# Altium schematic sheet Micro_Grid_Sch.SchDoc: Mini Grid Project
size 558 x 431 mm; Date: Nov 2024; ApprovedBy: -; CheckedBy: -; Author: Rushikesh R. Shirsat; DrawnBy: Rushikesh Shirsat; Engineer: Rushikesh Shirsat; Organization: -; Address1: Chicago, IL, USA; Address2: -; Address3: -; Address4: -; DocumentNumber: -; Revision: 1.0; SheetNumber: 1; SheetTotal: 1
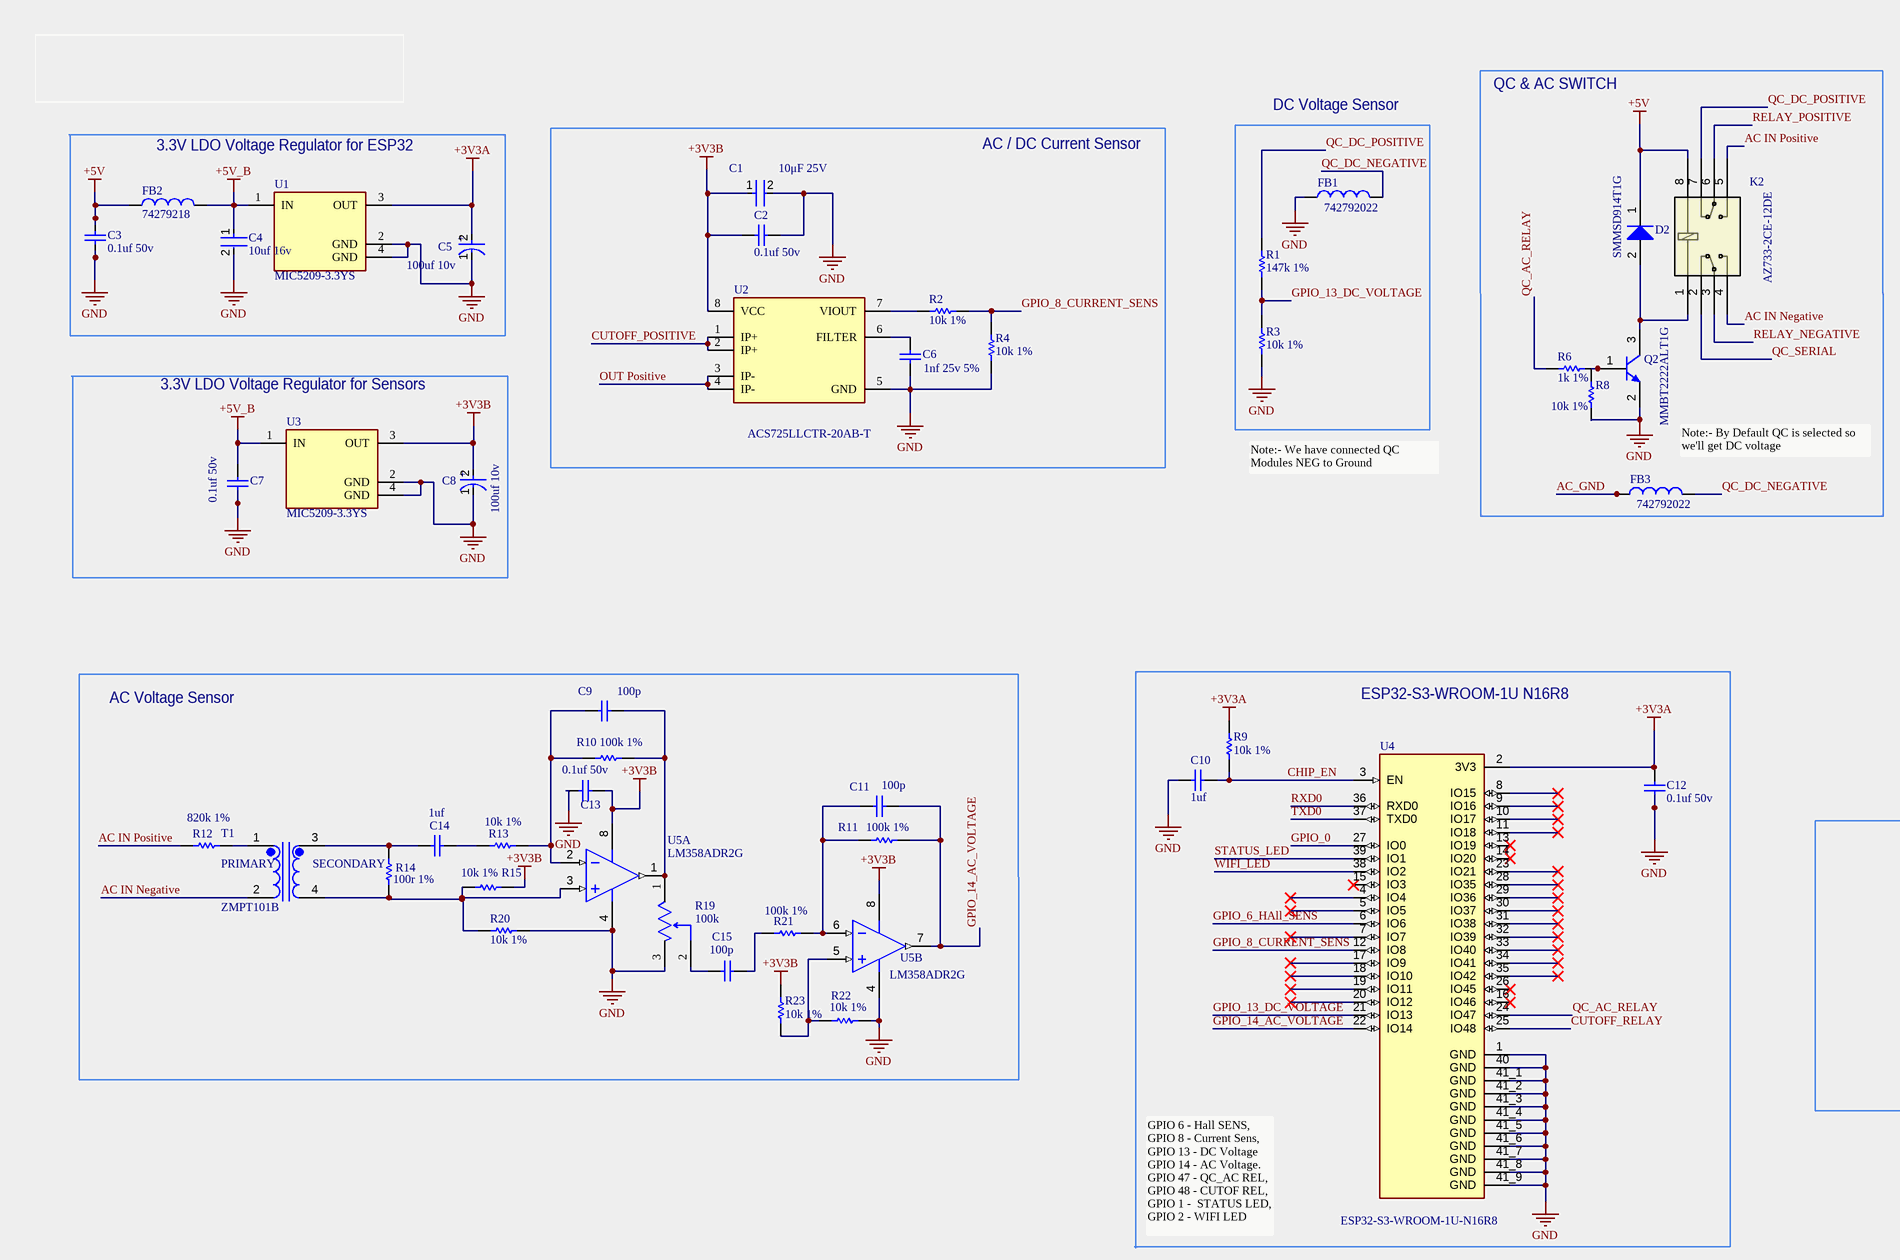
[diagram p0: Micro_Grid_Sch.SchDoc, top left]
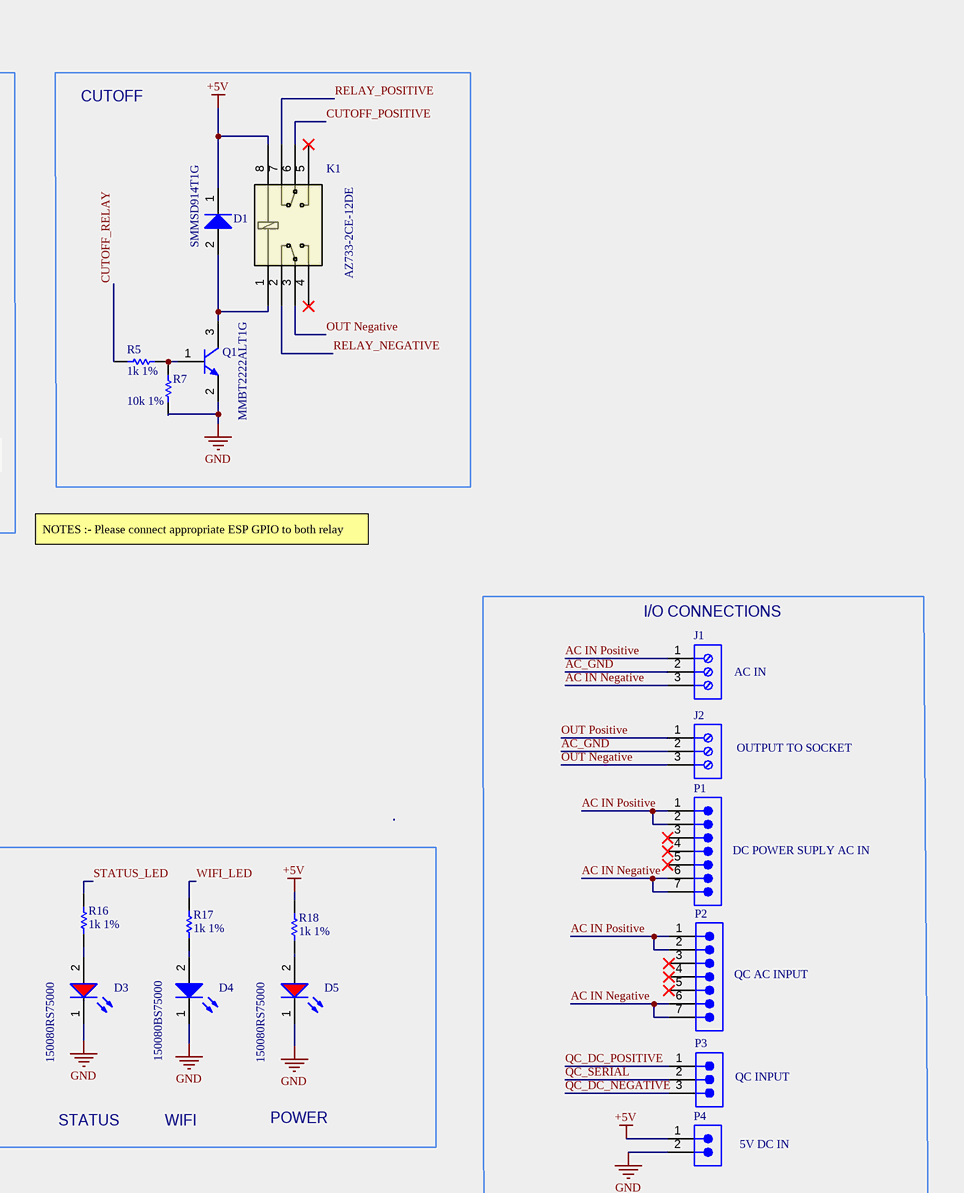
[diagram p1: Micro_Grid_Sch.SchDoc, top right]
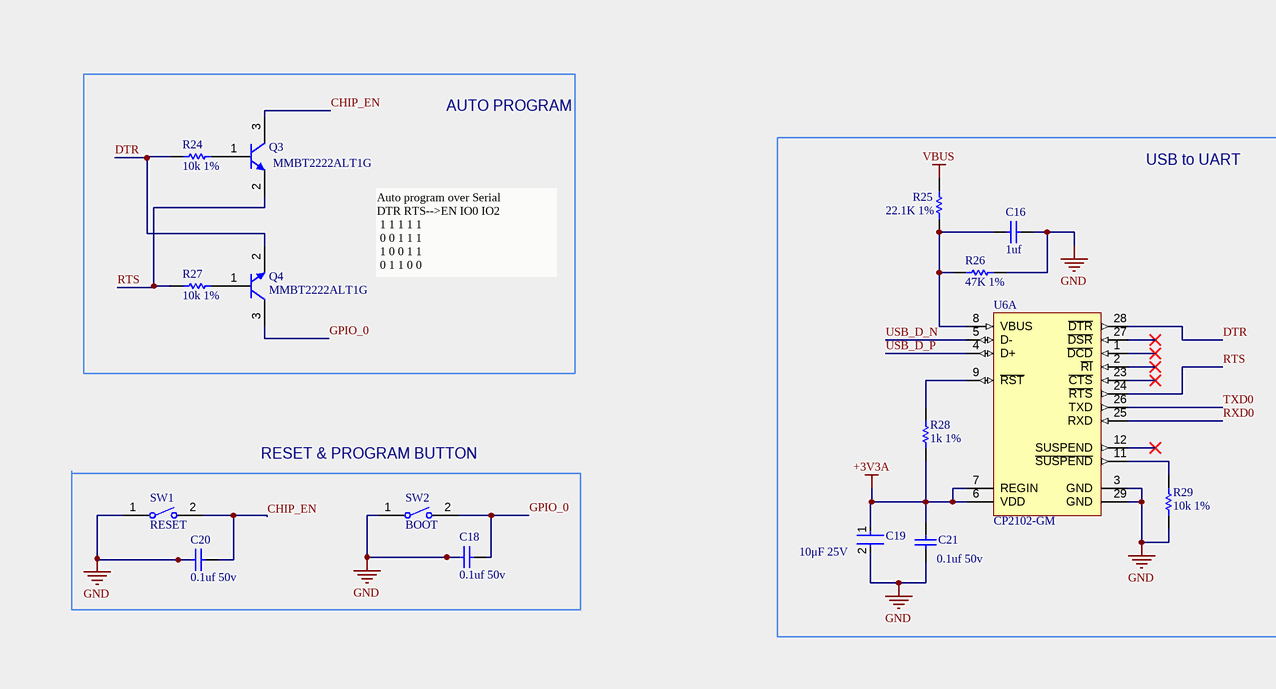
[diagram p2: Micro_Grid_Sch.SchDoc, bottom left]
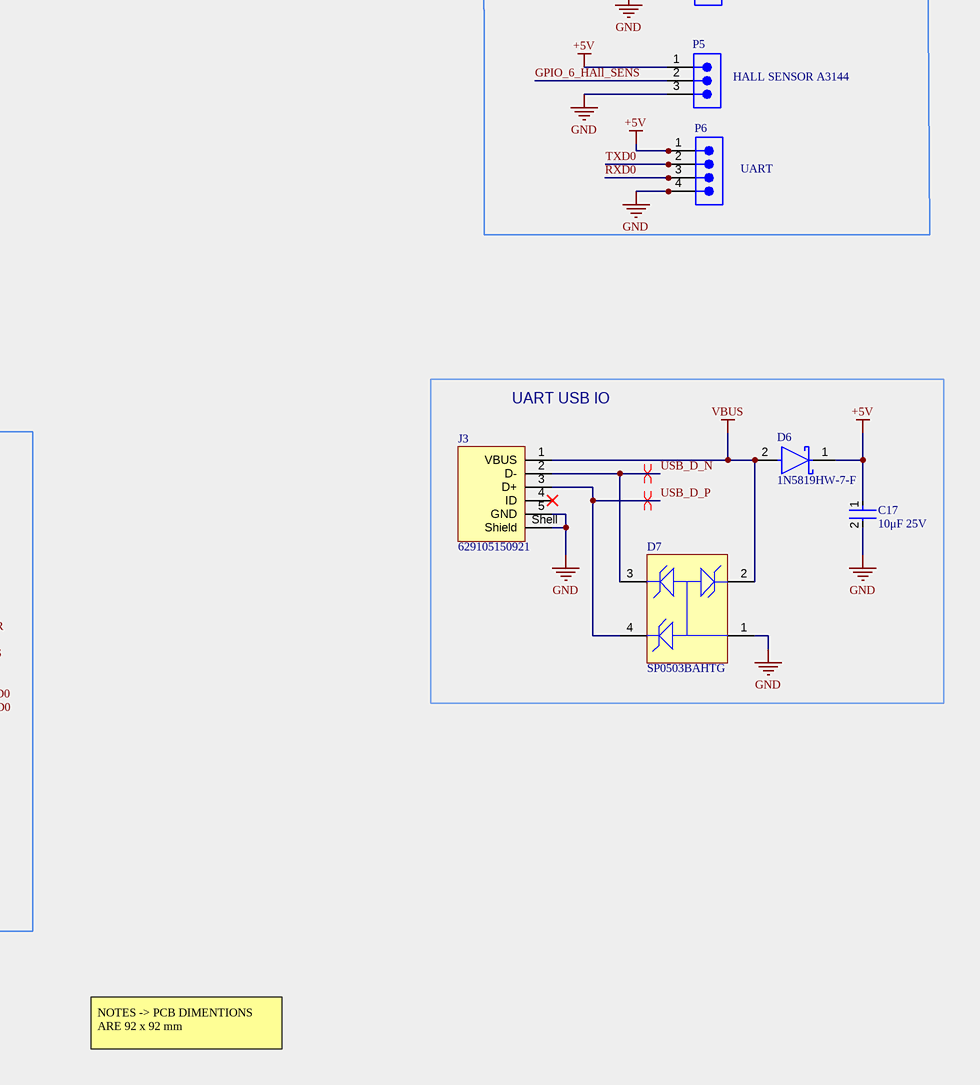
[diagram p3: Micro_Grid_Sch.SchDoc, bottom right]

## Parts
C1  10μF 25V  [FP-C2012-125-0_2-IPC_B]
C2  0.1uf 50v  [CAPC2013X140X50LL20T25]
C3  0.1uf 50v  [CAPC2013X140X50LL20T25]
C4  10uf 16v  [FP-GRM21B-0_1-IPC_C]
C5  100uf 10v  [FP-SC-MFG]
C6  1nf 25v 5%  [CAPC2013X145X50NL20T20]
C7  0.1uf 50v  [CAPC2013X140X50LL20T25]
C8  100uf 10v  [FP-SC-MFG]
C9  100p  [CAPC2013X140X50NL20T25]
C10  1uf  [CAPC2013X140X50LL20T25]
C11  100p  [CAPC2013X140X50NL20T25]
C12  0.1uf 50v  [CAPC2013X140X50LL20T25]
C13  0.1uf 50v  [CAPC2013X140X50LL20T25]
C14  1uf  [CAPC2013X140X50LL20T25]
C15  100p  [CAPC2013X140X50NL20T25]
C16  1uf  [CAPC2013X140X50LL20T25]
C17  10μF 25V  [FP-C2012-125-0_2-IPC_B]
C18  0.1uf 50v  [CAPC2013X140X50LL20T25]
C19  10μF 25V  [FP-C2012-125-0_2-IPC_B]
C20  0.1uf 50v  [CAPC2013X140X50LL20T25]
C21  0.1uf 50v  [CAPC2013X140X50LL20T25]
D1  SMMSD914T1G  [ONSC-SOD-123-2-425-04_V]
D2  SMMSD914T1G  [ONSC-SOD-123-2-425-04_V]
D3  150080RS75000  [WL-SMCW_0805_150080xx75000]
D4  150080BS75000  [WL-SMCW_0805_150080xx75000]
D5  150080RS75000  [WL-SMCW_0805_150080xx75000]
D6  1N5819HW-7-F  [FP-SOD123-IPC_A]
D7  SP0503BAHTG  [LFUS-SOT143-4_V]
FB1  742792022  [WE-CBF_0805_L2W1.2H0.9_HC]
FB2  74279218  [WE-CBF_1206_L3.2W1.6H1.1_HC]
FB3  742792022  [WE-CBF_0805_L2W1.2H0.9_HC]
J1  AC IN  [691214110003]
J2  OUTPUT TO SOCKET  [691214110003]
J3  629105150921  [629105150921]
K1  AZ733-2CE-12DE  [AZ733-2C_AMZ]
K2  AZ733-2CE-12DE  [AZ733-2C_AMZ]
P1  DC POWER SUPLY AC IN  [61300711121]
P2  QC AC INPUT  [61300711121]
P3  QC INPUT  [61300311121]
P4  5V DC IN  [61300211121]
P5  HALL SENSOR A3144  [61300311121]
P6  UART  [61300411121]
Q1  MMBT2222ALT1G  [ONSC-SOT-23-3-318-08_V]
Q2  MMBT2222ALT1G  [ONSC-SOT-23-3-318-08_V]
Q3  MMBT2222ALT1G  [ONSC-SOT-23-3-318-08_V]
Q4  MMBT2222ALT1G  [ONSC-SOT-23-3-318-08_V]
R1  147k 1%  [RESC2013X70X40LL20T20]
R2  10k 1%  [RESC2013X50X30NL20T20]
R3  10k 1%  [RESC2013X60X40NL15T20]
R4  10k 1%  [RESC2013X50X30NL20T20]
R5  1k 1%  [RESC2013X60X35ML10T20]
R6  1k 1%  [RESC2013X60X35ML10T20]
R7  10k 1%  [RESC2013X60X40NL15T20]
R8  10k 1%  [RESC2013X60X40NL15T20]
R9  10k 1%  [RESC2013X60X40NL15T20]
R10  100k 1%  [RESC2013X60X30NL20T20]
R11  100k 1%  [RESC2013X60X30NL20T20]
R12  820k 1%  [RESC2013X70X40ML20T20]
R13  10k 1%  [RESC2013X60X40NL15T20]
R14  100r 1%  [RESC2013X50X30LL20T20]
R15  10k 1%  [RESC2013X60X40NL15T20]
R16  1k 1%  [RESC2013X60X35ML10T20]
R17  1k 1%  [RESC2013X60X35ML10T20]
R18  1k 1%  [RESC2013X60X35ML10T20]
R19  100k  [FP-TS53YL-MFG]
R20  10k 1%  [RESC2013X60X40NL15T20]
R21  100k 1%  [RESC2013X60X30NL20T20]
R22  10k 1%  [RESC2013X60X40NL15T20]
R23  10k 1%  [RESC2013X60X40NL15T20]
R24  10k 1%  [RESC2013X60X40NL15T20]
R25  22.1K 1%  [RESC2013X70X40NL20T20]
R26  47K 1%  [RESC2013X60X35NL10T20]
R27  10k 1%  [RESC2013X60X40NL15T20]
R28  1k 1%  [RESC2013X60X35ML10T20]
R29  10k 1%  [RESC2013X60X35NL10T20]
SW1  RESET  [TECO-FSMSM-2_V]
SW2  BOOT  [TECO-FSMSM-2_V]
T1  ZMPT101B  [XFMR_ZMPT101B]
U1  MIC5209-3.3YS  [FP-SOT223-3LD-PL-1-IPC_A]
U2  ACS725LLCTR-20AB-T  [FP-LCN-8-IPC_B]
U3  MIC5209-3.3YS  [FP-SOT223-3LD-PL-1-IPC_A]
U4  ESP32-S3-WROOM-1U-N16R8  [XCVR_ESP32-S3-WROOM-1U-N16R8]
U5  LM358ADR2G  [ONSC-SOIC-8-751-07_V]  (parts A,B of 2)
U6  CP2102-GM  [SLAB-QFN-28-3125x3125TP_N]  (part A of 2)

## Blocks framed on the sheet
QC & AC SWITCH: D2 FB3 K2 Q2 R6 R8
CUTOFF: D1 K1 Q1 R5 R7
3.3V LDO Voltage Regulator for ESP32: C3-C5 FB2 U1
AC / DC Current Sensor: C1 C2 C6 R2 R4 U2
DC Voltage Sensor: FB1 R1 R3
3.3V LDO Voltage Regulator for Sensors: C7 C8 U3
I/O CONNECTIONS: J1 J2 P1-P6
ESP32-S3-WROOM-1U N16R8: C10 C12 R9 U4
AC Voltage Sensor: C9 C11 C13-C15 R10-R15 R19-R23 T1 U5
AUTO PROGRAM: Q3 Q4 R24 R27
UART USB IO: C17 D6 D7 J3
USB to UART: C16 C19 C21 R25 R26 R28 R29 U6
RESET & PROGRAM BUTTON: C18 C20 SW1 SW2

## Nets
+3V3A: C5.2(A) C12.2 C19.1 C21.2 R9.1 R28.2 U1.3(OUT) U4.2(3V3) U6.6(VDD) U6.7(REGIN)
+3V3B: C1.1 C2.2 C8.2(A) C13.1 R15.2 R23.2 U2.8(VCC) U3.3(OUT) U5.8(VCC)
+5V: C3.2 C17.1 D1.1(K) D2.1(K) D6.1(C) FB2.1 K1.8 K2.8 P4.1 P5.1 P6.1 R18.1
+5V_B: C4.1 C7.2 FB2.2 U1.1(IN) U3.1(IN)
GND: C1.2 C2.1 C3.1 C4.2 C5.1(C) C6.2 C7.1 C8.1(C) C10.1 C12.1 C13.2 C16.2 C17.2 C18.2 C19.2 C20.2 C21.1 D3.1(K) D4.1(K) D5.1(K) D7.1 FB1.1 J3.5(GND) J3.Shell(Shield) P4.2 P5.3 P6.4 Q1.2(E) Q2.2(E) R3.2 R4.1 R7.1 R8.1 R19.3(c) R20.2 R22.2 R26.2 R29.1 SW1.1 SW2.1 U1.2(GND) U1.4(GND) U2.5(GND) U3.2(GND) U3.4(GND) U4.1(GND) U4.40(GND) U4.41_1(GND) U4.41_2(GND) U4.41_3(GND) U4.41_4(GND) U4.41_5(GND) U4.41_6(GND) U4.41_7(GND) U4.41_8(GND) U4.41_9(GND) U5.4(VEE/GND) U6.3(GND) U6.29(GND)
VBUS: D6.2(A) D7.2 J3.1(VBUS) R25.2
AC IN Negative: J1.3 K2.4 P1.6 P1.7 P2.6 P2.7 T1.2
AC IN Positive: J1.1 K2.5 P1.1 P1.2 P2.1 P2.2 R12.1
AC_GND: FB3.1 J1.2 J2.2
CHIP_EN: C10.2 C20.1 Q3.3(C) R9.2 SW1.2 U4.3(EN)
CUTOFF_POSITIVE: K1.6 U2.1(IP+) U2.2(IP+)
CUTOFF_RELAY: R5.1 U4.25(IO48)
DTR: Q4.2(E) R24.2 U6.28(~{DTR})
GPIO_0: C18.1 Q4.3(C) SW2.2 U4.27(IO0)
GPIO_6_HAll_SENS: P5.2 U4.6(IO6)
GPIO_8_CURRENT_SENS: R2.2 R4.2 U4.12(IO8)
GPIO_13_DC_VOLTAGE: R1.2 R3.1 U4.21(IO13)
GPIO_14_AC_VOLTAGE: C11.2 R11.2 U4.22(IO14) U5.7(OUTB)
OUT Negative: J2.3 K1.3
OUT Positive: J2.1 U2.3(IP-) U2.4(IP-)
QC_AC_RELAY: R6.1 U4.24(IO47)
QC_DC_NEGATIVE: FB1.2 FB3.2 P3.3
QC_DC_POSITIVE: K2.7 P3.1 R1.1
QC_SERIAL: K2.2 P3.2
RELAY_NEGATIVE: K1.2 K2.3
RELAY_POSITIVE: K1.7 K2.6
RTS: Q3.2(E) R27.2 U6.24(~{RTS})
RXD0: P6.3 U4.36(RXD0) U6.25(RXD)
STATUS_LED: R16.1 U4.39(IO1)
TXD0: P6.2 U4.37(TXD0) U6.26(TXD)
USB_D_N: D7.3 J3.2(D-) U6.5(D-)
USB_D_P: D7.4 J3.3(D+) U6.4(D+)
WIFI_LED: R17.1 U4.38(IO2)
NetC6_1: C6.1 U2.6(FILTER)
NetC9_1: C9.1 R10.1 R13.2 U5.2(INA-)
NetC9_2: C9.2 R10.2 R19.1(a) U5.1(OUTA)
NetC11_1: C11.1 R11.1 R21.2 U5.6(INB-)
NetC14_1: C14.1 R14.2 T1.3
NetC14_2: C14.2 R13.1
NetC15_1: C15.1 R19.2(b)
NetC15_2: C15.2 R21.1
NetC16_1: C16.1 R25.1 R26.1 U6.8(VBUS)
NetD1_2: D1.2(A) K1.1 Q1.3(C)
NetD2_2: D2.2(A) K2.1 Q2.3(C)
NetD3_2: D3.2(A) R16.2
NetD4_2: D4.2(A) R17.2
NetD5_2: D5.2(A) R18.2
NetQ1_1: Q1.1(B) R5.2 R7.2
NetQ2_1: Q2.1(B) R6.2 R8.2
NetQ3_1: Q3.1(B) R24.1
NetQ4_1: Q4.1(B) R27.1
NetR2_1: R2.1 U2.7(VIOUT)
NetR12_2: R12.2 T1.1
NetR14_1: R14.1 R15.1 R20.1 T1.4 U5.3(INA+)
NetR22_1: R22.1 R23.1 U5.5(INB+)
NetR28_1: R28.1 U6.9(~{RST})
NetR29_2: R29.2 U6.11(~{SUSPEND})

Not connected (* = marked no-connect by the designer): J3 4(ID)*; K1 4* 5*; P1 3* 4* 5*; P2 3* 4* 5*; U4 4(IO4)* 5(IO5)* 7(IO7)* 8(IO15)* 9(IO16)* 10(IO17)* 11(IO18)* 13(IO19)* 14(IO20)* 15(IO3)* 16(IO46)* 17(IO9)* 18(IO10)* 19(IO11)* 20(IO12)* 23(IO21)* 26(IO45)* 28(IO35)* 29(IO36)* 30(IO37)* 31(IO38)* 32(IO39)* 33(IO40)* 34(IO41)* 35(IO42)*; U6 1(~{DCD})* 2(~{RI})* 12(SUSPEND)* 23(~{CTS})* 27(~{DSR})*

## Layout directives
differential pair: USB_D_N, USB_D_P

## Notes on the sheet
- Note:- We have connected QC Modules NEG to Ground
- Note:- By Default QC is selected so we'll get DC voltage
- NOTES :- Please connect appropriate ESP GPIO to both relay modules
- STATUS
- WIFI
- POWER
- GPIO 6 - Hall SENS, GPIO 8 - Current Sens, GPIO 13 - DC Voltage
  GPIO 14 - AC Voltage.    GPIO 47 - QC_AC REL, GPIO 48 - CUTOF REL, GPIO 1 -  STATUS LED, GPIO 2 - WIFI LED
- Auto program over Serial
  DTR RTS-->EN IO0 IO2
  1 1 1 1 1
  0 0 1 1 1
  1 0 0 1 1
  0 1 1 0 0
- NOTES -> PCB DIMENTIONS ARE 92 x 92 mm
- DWG. NO.
- REV.
- SHT.
- REVISION
- DESCRIPTION
- DATE
- APPROVED
- THIS DOCUMENT AND THE DATA DISCLOSED HEREIN OR HEREWITH IS THE PROPERTY OF ALTIUM LIMITED AND MAY BE FREELY DISTRIBUTED IN WHOLE. NO RIGHTS ARE RESERVED OR EXPRESS OR IMPLIED WARANTEE GIVEN.
- ENG:
- DSN:
- APPROVALS
- PROJECT
- DOCUMENT REVISION:
- DESIGN ITEM:
- CHK:
- BOM:
- REFERENCE DOCUMENTS
- PROJECT REVISION:
- TITLE
- FAB DWG:
- PCB DWG:
- ASSY DWG:
- SCALE:
- SIZE
- C
- CAGE CODE
- FILE NAME
- DWG NO.
- SHEET
- OF
- REV
- (in symbol CMP-05427-000047-1) +
- (in symbol ZMPT101B) PRIMARY; SECONDARY

## Library data of the parts
C1 C17 C19 = CMP-08246-002675-1: Multilayer Ceramic Capacitors 10μF ±10% 25V X5R SMD 0805; Capacitance: 10uF; Packaging: Tape and Reel; Dielectric: X5R; Case/Package: 0805; Lead Free: Lead Free; Dielectric Material: Ceramic; Series: C; Termination: SMD/SMT; Voltage: 25V; Depth: 1.25mm; Max Operating Temperature: 85°C; Voltage Rating (DC): 25V; Resistor Type: Ceramic; Weight: 0.000194oz; Case Code (Metric): 2012; Height: 1.25mm; Mount: Surface Mount; Voltage Rating: 25V; Length: 2mm; REACH SVHC: No SVHC; Min Operating Temperature: -55°C; Case Code (Imperial): 0805; Thickness: 0.057inch; Width: 0.049inch; Tolerance: 10%; Package Quantity: 1
C2 C3 C7 C12 C13 C18 C20 C21 = CMP-2007-04784-1: 08055F104KAT2A; Manufacturer: AVX Interconnect / Elco; Part Number: 08055F104KAT2A
C4 = CMP-2007-03453-2: Chip Multilayer Ceramic Capacitors for General Purpose, 0805, 10uF, X5R, 15%, 10%, 16V; Radiation Hardening: No; Thickness: 0.053inch; Voltage Rating (DC): 16V; Lead Free: Lead Free; Package Quantity: 1; Width: 1.25mm; Case Code (Imperial): 0805; Depth: 1.25mm; Packaging: Tape and Reel; Dielectric: X5R; Max Operating Temperature: 85°C; Tolerance: 10%; Voltage Rating: 16V; Voltage: 16V; Capacitance: 10uF; Height: 1.25mm; Case Code (Metric): 2012; Material: Ceramic; Mount: Surface Mount; Case/Package: 0805; REACH SVHC: No SVHC; Length: 2mm; Min Operating Temperature: -55°C; Termination: SMD/SMT
C5 C8 = CMP-05427-000047-1: EEE-1AA101WR, CAP ALUM 100UF 20% 10V SMD; Life (Hours): 1000Hour; Ripple Current: 50mA; Packaging: Tape and Reel; Diameter: 5mm; Voltage Rating (DC): 10V; Mount: Surface Mount; Max Operating Temperature: 85°C; Length: 5.5mm; Case/Package: Radial; Height: 5.4mm; Construction: Cylindrical; Termination: SMD/SMT; Height - Seated (Max): 0.213inch; Series: S; Min Operating Temperature: -40°C; Capacitance: 100uF; Tolerance: 20%; Voltage Rating: 10V; Package Quantity: 1; Radiation Hardening: No; Ripple Current (AC): 50mA; Lead Free: Lead Free; RoHS Compliant: Yes; Contact Plating: Tin
C6 = CMP-2007-01395-1: VJ0805Y102JXXPW1BC; Manufacturer: Vitramon; Part Number: VJ0805Y102JXXPW1BC
C9 C11 C15 = CMP-2007-03324-1: C0805C101KCGACTU; Manufacturer: Kemet; Part Number: C0805C101KCGACTU
C10 C14 C16 = CMP-2007-03234-1: C0805C105K3RACTU; Manufacturer: Kemet; Part Number: C0805C105K3RACTU
D1 D2 = CMP-1054-00051-1: SMMSD914T1G, Switching Diode, 2-Pin SOD-123, Pb-Free, Tape and Reel; Manufacturer: On Semiconductor; trr Max (ns): 4; IF Max (A): 0.2; Configuration: Single; ComponentLink2Description: Datasheet; PackageReference: SOD-123-2-425-04; PackageVersion: Rev. G, 10/2009; DatasheetVersion: Rev. 11; ComponentLink3Description: Package Specification; ComponentLink1URL: http://www.onsemi.com/; ComponentLink3URL: http://www.onsemi.com/pub_link/Collateral/425-04.PDF; ComponentLink1Description: Manufacturer URL; ComponentLink2URL: http://www.onsemi.com/pub_link/Collateral/MMSD914T1-D.PDF; Packing: Tape and Reel; Mounting Technology: Surface Mount; PartNumber: SMMSD914T1G; RoHS: TRUE; PackageDescription: 2-Pin SOD, Body 1.6 x 2.69 mm
D3 D5 = CMP-1426-00011-3: LED Uni-Color Red 630nm 2-Pin Chip 0805(2012Metric) T/R; Viewing Angle: 140°; Max Junction Temperature (Tj): 95°C; Power Dissipation: 72mW; Forward Current: 100mA; Forward Voltage: 2V; Wavelength: 625nm; Test Current: 20mA; Max Reverse Voltage (DC): 5V; Luminous Intensity: 150mcd; Lens Style: Clear, Rectangular; REACH SVHC: Unknown; Height: 700µm; Case Code (Metric): 2012; Peak Wavelength: 630nm; Length: 2mm; Width: 1.25mm; RoHS: Compliant; Packaging: Tape and Reel; Dominant Wavelength: 625nm; Color: Red; Case Code (Imperial): 0805; Min Operating Temperature: -40°C; Mount: Surface Mount; Max Operating Temperature: 85°C; Case/Package: 0805
D4 = CMP-1426-00008-7: Led, Blue, 470 Nm, 3.2 V, 30 Ma, 145 Mcd Rohs Compliant: Yes; Dominant Wavelength: 470nm; Max Junction Temperature (Tj): 95°C; Power Dissipation: 105mW; Peak Wavelength: 465nm; Max Reverse Voltage (DC): 5V; Forward Current: 100mA; Test Current: 20mA; Luminous Intensity: 145mcd; Lens Style: Clear, Rectangular; Viewing Angle: 140°; Forward Voltage: 3.2V; Color: Blue; Height: 700µm; Case Code (Imperial): 0805; Width: 1.25mm; REACH SVHC: Unknown; Case/Package: 0805; Lead Free: Lead Free; Mount: Surface Mount; Packaging: Tape and Reel; RoHS: Compliant; Reverse Voltage: 5V; Min Operating Temperature: -40°C; Case Code (Metric): 2012; Wavelength: 470nm; Max Operating Temperature: 85°C; Length: 2mm
D6 = CMP-0303-00003-3: DIODE SCHOTTKY 40V 1A SOD123; Forward Voltage: 450mV; Capacitance: 110pF; Max Forward Surge Current (Ifsm): 25A; Peak Reverse Current: 50uA; Polarity: Standard; Element Configuration: Single; Max Power Dissipation: 450mW; Min Operating Temperature: -65°C; Package Quantity: 3000; Contact Plating: Tin; Weight: 0.000353oz; Max Repetitive Reverse Voltage (Vrrm): 40V; Max Reverse Voltage (DC): 40V; Height: 1.25mm; Average Rectified Current: 1A; Width: 1.7mm; Case/Package: SOD-123-2; Lead Free: Lead Free; Max Operating Temperature: 125°C; Current Rating: 1A; Termination: SMD/SMT; Forward Current: 1A; Radiation Hardening: No; Number of Pins: 2; Length: 2.85mm; Voltage Rating (DC): 40V; REACH SVHC: No SVHC; Peak Non-Repetitive Surge Current: 25A; Packaging: Tape and Reel; Output Current: 1A
D7 = CMP-2000-05191-1: TVS Diode Array, 30 pF, 30 KV, -40 to 85 degC, 4-Pin SOT143, RoHS, Tape and Reel; Manufacturer: Littelfuse; Direction Type: Uni-Directional; Product Height (mm): 1.05mm; Leakage Current (Max): 0.1uA; Clamping Voltage (Max): 8V; Reverse Stand-off Voltage: 5.5(Min)V; Configuration: Triple; Working Voltage: 5.5V; Product Length (mm): 3.04mm; Working Voltage (Max): 5.5V(Min); Capacitance Value: 30pF; Rad Hardened: No; Number of Elements: 3; Product Depth (mm): 1.4mm; Operating Temperature Max Deg. C: 85C; Suppressor Type: TVS; Operating Temperature Min Deg. C: -40C; Operating Temp Range: -40Cto85C; Mounting: SurfaceMount; Package / Case: SOT-143; Datasheet Version: Dec-13; Package Type: SOT-143; Packaging: TapeandReel; Pin Count: 3+Tab; Operating Temperature Classification: Industrial; Datasheet URL: https://datasheet.ciiva.com/15143/getdatasheetpartid-116020-15143550.pdf; Manufacturer URL: http://www.littelfuse.com/; Leakage Current: 0.1uA; Mounting Style: SurfaceMount; Clamping Voltage: 8V; Polarity: Uni-Directional
FB1 FB3 = CMP-0220-00029-2: NexarPartId: 7861696; Resistance: 50mΩ; Number of Lines: 1; Tolerance: 25%; Test Frequency: 100MHz; Max Current Rating: 2A; Inductance: 5.6H; Impedance: 220Ω; RoHS: Compliant; Max Operating Temperature: 125°C; Case Code (Metric): 2012; Depth: 1.2mm; Case Code (Imperial): 0805; REACH SVHC: Unknown; Min Operating Temperature: -55°C; Core Material: Ferrite; Length: 2mm; Case/Package: SMD/SMT; Termination: SMD/SMT; Packaging: Digi-Reel®; Height: 900µm; Lead Free: Lead Free; Weight: 10.999615mg; Current Rating: 2A; Max DC Current: 2A; Width: 1.2mm; DC Resistance (DCR): 50mΩ; Mount: Surface Mount; Material: Ferrite
FB2 = CMP-0220-00015-3: NexarPartId: 21041562; Impedance: 600Ω; Max DC Current: 2A; DC Resistance (DCR): 100mΩ; Number of Lines: 1; Tolerance: 25%; Test Frequency: 100MHz; Case Code (Imperial): 1206; Weight: 28.009329mg; Depth: 1.6mm; Packaging: Cut Tape (CT); RoHS: Compliant; Max Current Rating: 2A; Series Resistance: 100mΩ; Lead Free: Lead Free; RMS Current (Irms): 2A; Width: 1.6mm; Case/Package: 1206; Case Code (Metric): 3216; Height: 1.1mm; Mount: Surface Mount; Termination: SMD/SMT; Min Operating Temperature: -55°C; Resistance: 100mΩ; REACH SVHC: Unknown; Length: 3.2mm; Current Rating: 2A; Core Material: Ferrite; Max Operating Temperature: 125°C
J1 J2 = CMP-1502-02466-2: NexarPartId: 18818289; Number of Levels: 1; Voltage: 300V; Pitch: 3.5052mm; Stripping Length: -6mm; Number of Positions Per Level: 3; Plating: Brass, Steel; Wire/Cable Gauge: 24AWG; Wire Gauge (Min): 16AWG; Current Rating: 10A; Width: 10.9mm; Length: 7.4mm; Housing Material: Nylon; Height: 12.2mm; Min Operating Temperature: -40°C; Contact Plating: Brass, Tin; Packaging: Box; Color: Blue, Green; Number of Contacts: 3; Number of Pins: 3; Voltage Rating: 300V; Termination: Screw; Lead Pitch: 3.5mm; Max Operating Temperature: 105°C; Mount: Through Hole; Contact Material: Brass; RoHS: Compliant; Wire Gauge (Max): 24AWG; Current: 10A; REACH SVHC: Unknown
J3 = CMP-1502-03249-5: NexarPartId: 52645114; Operating Supply Voltage: 30V; Insulation Resistance: 1GΩ; Connector Type: USB; Current Rating: 1.8A; Number of Contacts: 5; Gender: Receptacle; USB Standard: USB 2.0; Contact Resistance: 30mΩ; Orientation: Horizontal; Height: 2.82mm; Packaging: Tape and Reel; Features: Shielded; Voltage Rating: 30V; Mount: Horizontal, Surface Mount; Termination: SMD/SMT; Contact Plating: Gold; Contact Material: Gold; REACH SVHC: Unknown; Min Operating Temperature: -40°C; Max Operating Temperature: 85°C; Number of Pins: 5; RoHS: Compliant
K1 K2 = AZ733-2CE-12DE: No Description Available; Mfr_Name: American Zettler; Type: Power Relays; RefDes: RefDes
P1 P2 = CMP-1502-01074-3: NexarPartId: 32855531; Current Rating: 3A; Number of Positions: 7; Connector Type: Male Pin; Gender: Male; Operating Supply Voltage: 250V; Pitch: 2.54mm; Contact Resistance: 20mΩ; Contact Material: Copper; Contact Plating: Gold; Contact Mating Length: 5.9944mm; Mount: Through Hole; Termination: Solder; Number of Pins: 7; Color: Black; Packaging: Bulk; REACH SVHC: Unknown; Orientation: Vertical; Lead Pitch: 2.54mm; RoHS: Compliant; Number of Rows: 1; Number of Contacts: 7
P3 P5 = CMP-1502-01062-3: NexarPartId: 32855521; Current Rating: 3A; Voltage Rating: 250V; Number of Positions: 3; Pitch: 2.54mm; Contact Resistance: 20mΩ; Connector Type: Male Pin; Gender: Male; REACH SVHC: Unknown; Packaging: Bulk; Contact Material: Copper; Min Operating Temperature: -40°C; Number of Rows: 1; Orientation: Vertical; RoHS: Compliant; Contact Plating: Gold; Max Operating Temperature: 105°C; Mount: Through Hole; Height: 8.94mm; Operating Supply Voltage: 250V; Number of Pins: 3; Contact Mating Length: 5.9944mm; Number of Contacts: 3; Color: Black; Lead Free: Lead Free; Lead Pitch: 2.54mm; Termination: Solder
P4 = CMP-1712-00002-6: NexarPartId: 20081794; Number of Contacts: 2; Pitch: 2.54mm; Connector Type: Male Pin; Voltage Rating: 250V; Current Rating: 3A; Gender: Male; Contact Resistance: 20mΩ; Height: 8.94mm; Lead Free: Lead Free; Number of Pins: 2; Termination: Through Hole; RoHS: Compliant; Lead Pitch: 2.54mm; REACH SVHC: No SVHC; Housing Material: PBT; Contact Mating Length: 5.9944mm; Min Operating Temperature: -40°C; Orientation: Vertical; Contact Material: Copper; Contact Gender: Male; Max Operating Temperature: 125°C; Number of Rows: 1; Number of Positions: 2; Packaging: Bulk; Contact Plating: Gold; Mount: Through Hole; Color: Black; Operating Supply Voltage: 250V
P6 = CMP-1502-01064-3: NexarPartId: 32855522; Operating Supply Voltage: 250V; Pitch: 2.54mm; Contact Resistance: 20mΩ; Number of Positions: 4; Current Rating: 3A; Connector Type: Male Pin; Gender: Male; Contact Plating: Gold; Height: 8.89mm; Lead Pitch: 2.54mm; Lead Free: Lead Free; Contact Mating Length: 5.9944mm; Number of Rows: 1; Termination: Solder; Packaging: Bulk; REACH SVHC: Unknown; Min Operating Temperature: -40°C; RoHS: Compliant; Number of Contacts: 4; Voltage Rating: 250V; Color: Black; Max Operating Temperature: 105°C; Contact Material: Copper; Mount: Through Hole; Orientation: Vertical; Number of Pins: 4
Q1-Q4 = CMP-1048-00538-1: General Purpose Transistor, NPN Silicon, 3-Pin SOT-23, Pb-Free, Tape and Reel; Manufacturer: On Semiconductor; fT Min (MHz): 300; IC Continuous (A): 0.6; ComponentLink3URL: http://www.onsemi.cn/pub_link/Collateral/318-08.PDF; PartNumber: MMBT2222ALT1G; RoHS: TRUE; ComponentLink1URL: http://www.onsemi.com/; ComponentLink3Description: Package Specification; ComponentLink2Description: Datasheet; Mounting Technology: Surface Mount; Packing: Tape and Reel; PackageDescription: 3-Pin Small Outline Transistor, Body 2.92 x 1.3 mm, Pitch 0.95 mm; DatasheetVersion: Rev. 10; PackageReference: SOT-23-3-318-08; ComponentLink2URL: http://www.onsemi.cn/pub_link/Collateral/MMBT2222LT1-D.PDF; Polarity: NPN; PackageVersion: Rev. AP, 11/2009; ComponentLink1Description: Manufacturer URL
R1 = CMP-2001-04436-1: ERJ-6ENF1473V; Manufacturer: Panasonic; Part Number: ERJ-6ENF1473V
R2 R4 = CMP-2001-04915-1: Manufacturer: Vishay Dale; Part Number: CRCW080510R0FKEA
R3 R7-R9 R13 R15 R20 R22-R24 R27 = CMP-2001-04472-1: CRCW080510K0FKEAHP; Manufacturer: Vishay Dale; Part Number: CRCW080510K0FKEAHP
R5 R6 R16-R18 = CMP-2100-03671-1: RC0805FR-071KL Chip Resistor, 1 KOhm, +/- 1%, 125 mW, -55 to 155 degC, 0805 (2012 Metric), RoHS, Tape and Reel; Manufacturer: Yageo; Temperature Coefficient: 100ppm/degreesC; Voltage Rating (DC): 150V; Max Power Dissipation: 125mW; Resistance: 1KOhm; Number of Pins: 2; Number of Terminations: 2; Datasheet URL: http://www.yageo.com/NewPortal/yageodocoutput?fileName=/pdf/R-Chip/PYu-RC_Group_51_RoHS_L_5.pdf; Length: 0.079inch; Package Description: 2-Pin Surface Mounted Device, Body 2 x 1.25 mm; Depth: 1.25mm; Height: 0.024inch; Military Standard: Not; Case/Package: 0805; Package Reference: 0805; RoHSCompliant: true; Lead Free: LeadFree; Packaging: TapeandReel; Package Quantity: 1; Datasheet Version: Rev. 5, 10/2016; Tolerance: 1%; Min Operating Temperature: -55degC; Voltage Rating: 150V; Composition: ThickFilm; Case Code (Imperial): 0805; Power Rating: 125mW; Width: 0.049inch; Case Code (Metric): 2012; Manufacturer URL: http://www.yageo.com/; Max Operating Temperature: 155degC; REACH SVHC: Unknown; Termination: SMD/SMT
R10 R11 R21 = CMP-2001-01994-1: RK73H2ATTD1003F; Manufacturer: KOA Speer; Part Number: RK73H2ATTD1003F
R12 = CMP-2001-00574-1: ERJ6ENF8203V; Manufacturer: Panasonic; Part Number: ERJ6ENF8203V
R14 = CMP-2001-04901-1: CRCW0805100RFKEA; Manufacturer: Vishay Dale; Part Number: CRCW0805100RFKEA
R19 = CMP-00030-39740690-1: TS53YL104MR10 Resistor Trimmer, Cermet, 100 kOhm, ± 20%, 250 mW, 1 Turn, Single Turn, Surface Mount; Voltage Rating (AC): 200V; Temperature Coefficient: 100ppm/°C; Number of Turns: 1; Voltage Rating: 158V; Resistance: 100kΩ; Power Rating: 250mW; Min Operating Temperature: -55°C; Taper: Linear; RoHS: Compliant; Height: 2.6924mm; Max Operating Temperature: 125°C; REACH SVHC: Unknown; Termination: Gull Wing; Radiation Hardening: No; Lead Free: Lead Free; Length: 5mm; Composition: Cermet; Mount: Surface Mount; Depth: 6.4mm; Military Standard: Not; Voltage Rating (DC): 200V; Tolerance: 20%; Schedule B: 8533400080, 8533400080; Width: 5.0038mm; NexarPartId: 39740690; Max Power Dissipation: 250mW; Packaging: Cut Tape
R25 = CMP-2001-00049-1: ERJ-6ENF2212V; Manufacturer: Panasonic; Part Number: ERJ-6ENF2212V
R26 = CMP-1659-00011-4: RC0805FR-0747KL, Chip Resistor, 47 KOhm, +/- 1%, 0.125 W, -55 to 155 degC, 0805 (2012 Metric), RoHS, Tape and Reel; Manufacturer: Yageo; Voltage Rating: 150 V; Height: 0.5 mm; ComponentLink2URL: http://www.yageo.com/documents/recent/PYu-RC_Group_51_RoHS_L_04.pdf; ComponentLink2Description: Datasheet; Package Quantity: 200; Max Operating Temperature: 155 degC; Min Operating Temperature: -55 degC; Packaging: Tape and Reel; Pins: 2; PackageReference: 0805; Mounting Technology: Surface Mount; ComponentLink1Description: Manufacturer URL; ComponentLink1URL: http://www.yageo.com/; PackageDescription: 2-Pin Surface Mounted Device, Body 2 x 1.25 mm; Length: 2 mm; REACH SVHC: No SVHC; Mount: Surface Mount; RoHSCompliant: true; DatasheetVersion: Rev. 4, 02/2016
R28 = CMP-2100-03671-1: RC0805FR-071KL, Chip Resistor, 1 KOhm, +/- 1%, 125 mW, -55 to 155 degC, 0805 (2012 Metric), RoHS, Tape and Reel; Manufacturer: Yageo; Temperature Coefficient: 100ppm/degreesC; Voltage Rating (DC): 150V; Max Power Dissipation: 125mW; Resistance: 1KOhm; Number of Pins: 2; Number of Terminations: 2; Datasheet URL: http://www.yageo.com/NewPortal/yageodocoutput?fileName=/pdf/R-Chip/PYu-RC_Group_51_RoHS_L_5.pdf; Length: 0.079inch; Package Description: 2-Pin Surface Mounted Device, Body 2 x 1.25 mm; Depth: 1.25mm; Height: 0.024inch; Military Standard: Not; Case/Package: 0805; Package Reference: 0805; RoHSCompliant: true; Lead Free: LeadFree; Packaging: TapeandReel; Package Quantity: 1; Datasheet Version: Rev. 5, 10/2016; Tolerance: 1%; Min Operating Temperature: -55degC; Voltage Rating: 150V; Composition: ThickFilm; Case Code (Imperial): 0805; Power Rating: 125mW; Width: 0.049inch; Case Code (Metric): 2012; Manufacturer URL: http://www.yageo.com/; Max Operating Temperature: 155degC; REACH SVHC: Unknown; Termination: SMD/SMT
R29 = CMP-1659-00013-4: RC0805FR-0710KL, Chip Resistor, 10 KOhm, +/- 1%, 0.125 W, -55 to 155 degC, 0805 (2012 Metric), RoHS, Tape and Reel; Manufacturer: Yageo; Voltage Rating: 150 V; Mount: Surface Mount; ComponentLink1Description: Manufacturer URL; ComponentLink2URL: http://www.yageo.com/documents/recent/PYu-RC_Group_51_RoHS_L_04.pdf; Pins: 2; Length: 2 mm; Min Operating Temperature: -55 degC; Height: 0.5 mm; Mounting Technology: Surface Mount; RoHSCompliant: true; REACH SVHC: No SVHC; ComponentLink1URL: http://www.yageo.com/; Max Operating Temperature: 155 degC; PackageReference: 0805; DatasheetVersion: Rev. 4, 02/2016; Package Quantity: 5000; Packaging: Tape and Reel; ComponentLink2Description: Datasheet; PackageDescription: 2-Pin Surface Mounted Device, Body 2 x 1.25 mm
SW1 SW2 = CMP-2000-07511-1: FSMSM Push Button Switch, 50 mA, -35 to 85 degC, 2-Pin SMD, RoHS, Bulk; Manufacturer: TE Connectivity; Actuator Length: 1.07mm; Electrical Life: 20000Cycles; Actuator Material: Polyamide; Current Rating: 50mA; Illumination Type: Illuminated; Voltage Rating (DC): 24V; Contact Resistance: 100mOhm; Case\/Package: SMD/SMT; Operating Force: 180gf; Switch Travel: 0.25mm; Max Voltage Rating (DC): 12V; Throw Configuration: SPST; Packaging: LoosePiece; Max Operating Temperature: 85degC; ELV: Compliant; Package Description: 2-Pin Surface Mount Device, Body 6 x 3.5 mm, Pitch 9.19 mm; RoHSCompliant: true; Manufacturer URL: http://www.te.com/; Contact Plating: Silver; Contact Material: Brass; Mounting Technology: SurfaceMount; Contact Current Rating: 50mA; Datasheet Version: Rev. C2, 08/2014; Datasheet URL: http://www.te.com/commerce/DocumentDelivery/DDEController?Action=showdoc&DocId=Customer+Drawing%7F1437566-3%7FC2%7Fpdf%7FEnglish%7FENG_CD_1437566-3_C2_1437566_3_1_c.dwg.pdf%7F1437566-3; Mechanical Life: 20000Cycles; Package Reference: FSMSM; REACH SVHC: Unknown; Orientation: Straight; Min Operating Temperature: -35degC; Lead Free: LeadFree; Termination: GullWing; Package Quantity: 1000; Mount: SurfaceMount
T1 = ZMPT101B: Current-type Voltage Transformer; MF: Qingxian Zeming Langxi Electronic; SnapEDA_Link: https://www.snapeda.com/parts/ZMPT101B/Qingxian+Zeming+Langxi+Electronic/view-part/?ref=snap; Package: None; MP: ZMPT101B; Check_prices: https://www.snapeda.com/parts/ZMPT101B/Qingxian+Zeming+Langxi+Electronic/view-part/?ref=eda; Price: None; Value: *; Availability: Not in stock
U1 U3 = CMP-06324-000044-1: IC REG LINEAR 3.3V 500MA SOT223; Min Input Voltage: 2.5V; Number of Regulators: 1; Output Type: Fixed; Max Input Voltage: 16V; Dropout Voltage: 350mV; Mount: Surface Mount; Output Current: 500mA; Min Operating Temperature: -40°C; Nominal Output Voltage: 3.3V; Max Operating Temperature: 125°C; Case/Package: SOT-223; Packaging: Rail/Tube; Number of Pins: 3; REACH SVHC: No SVHC; Output Voltage: 3.3V
U2 = CMP-82923-000001-3: SENSOR CURRENT HALL 20A AC/DC; Accuracy: 0.8%; Linearity: 1.5%; Polarity: Bidirectional; Bandwidth: 120kHz; Number of Channels: 1; Sensitivity: 66mV/A; Quiescent Current: 10mA; Response Time: 4us; Max Supply Current: 14mA; Frequency: 120kHz; Min Operating Temperature: -40°C; Max Operating Temperature: 150°C; Case/Package: SOIC; Current Sensing: 20A; Packaging: Tape and Reel; Number of Pins: 8; Mount: Surface Mount; RoHS Compliant: Yes
U4 = ESP32-S3-WROOM-1U-N16R8: Bluetooth, WiFi 802.11b/g/n, Bluetooth v5.0 Transceiver Module 2.4GHz Antenna Not Included, U.FL Surface Mount; MF: Espressif Systems; Package: None; Price: None; Value: *; SnapEDA_Link: https://www.snapeda.com/parts/ESP32-S3-WROOM-1U-N16R8/Espressif+Systems/view-part/?ref=snap; MP: ESP32-S3-WROOM-1U-N16R8; Availability: Unavailable; Check_prices: https://www.snapeda.com/parts/ESP32-S3-WROOM-1U-N16R8/Espressif+Systems/view-part/?ref=eda
U5 = CMP-1310-00289-1: Single Supply Dual Operational Amplifier, 3 to 32 V, 0 to 70 degC, 8-Pin SOIC, Pb-Free, Tape and Reel; Manufacturer: On Semiconductor; VCC Min (V): 3; VCC Max (V): 32; DatasheetVersion: Rev. 27; ComponentLink1URL: http://www.onsemi.com/; PackageVersion: Rev. AK, 02/2011; Packing: Tape and Reel; ComponentLink3URL: http://www.onsemi.com/pub_link/Collateral/751-07.PDF; ComponentLink2URL: http://www.onsemi.cn/pub_link/Collateral/LM358-D.PDF; Mounting Technology: Surface Mount; PackageReference: SOIC-8-751-07; PackageDescription: 8-Pin Small Outline Integrated Circuit, Body 4.9 x 3.9 mm, Pitch 1.27 mm; ComponentLink3Description: Package Specification; ComponentLink2Description: Datasheet; RoHS: TRUE; ComponentLink1Description: Manufacturer URL; PartNumber: LM358ADR2G
U6 = CMP-0511-00012-1: Single-Chip USB to UART Bridge, 1024 Bytes EEPROM, -40 to 85 degC, 28-pin QFN, Tube; Manufacturer: Silicon Labs; Internal Oscillator: TRUE; Sub-Family: USB Bridges; ComponentLink3Description: Package Specification; PackageDescription: 28-Pin Quad-Flat No-Leads Package, Body 5 x 5 mm, Pitch 0.5 mm; PartNumber: CP2102-GM; EEPROM: 1024 Bytes; Mounting Technology: Surface Mount; ComponentLink2URL: http://www.silabs.com/Support%20Documents/TechnicalDocs/CP2102-9.pdf; DatasheetVersion: Rev. 1.5; ComponentLink1URL: http://www.silabs.com/; ComponentLink2Description: Datasheet; Code_JEDEC: MO-220; PackageReference: QFN-28; Code_IPC: J-STD-020C; ComponentLink3URL: http://www.silabs.com/Support%20Documents/TechnicalDocs/C8051T61x.pdf; ComponentLink1Description: Manufacturer URL